# EAGLE design vestibular (EAGLE 9.6.2)
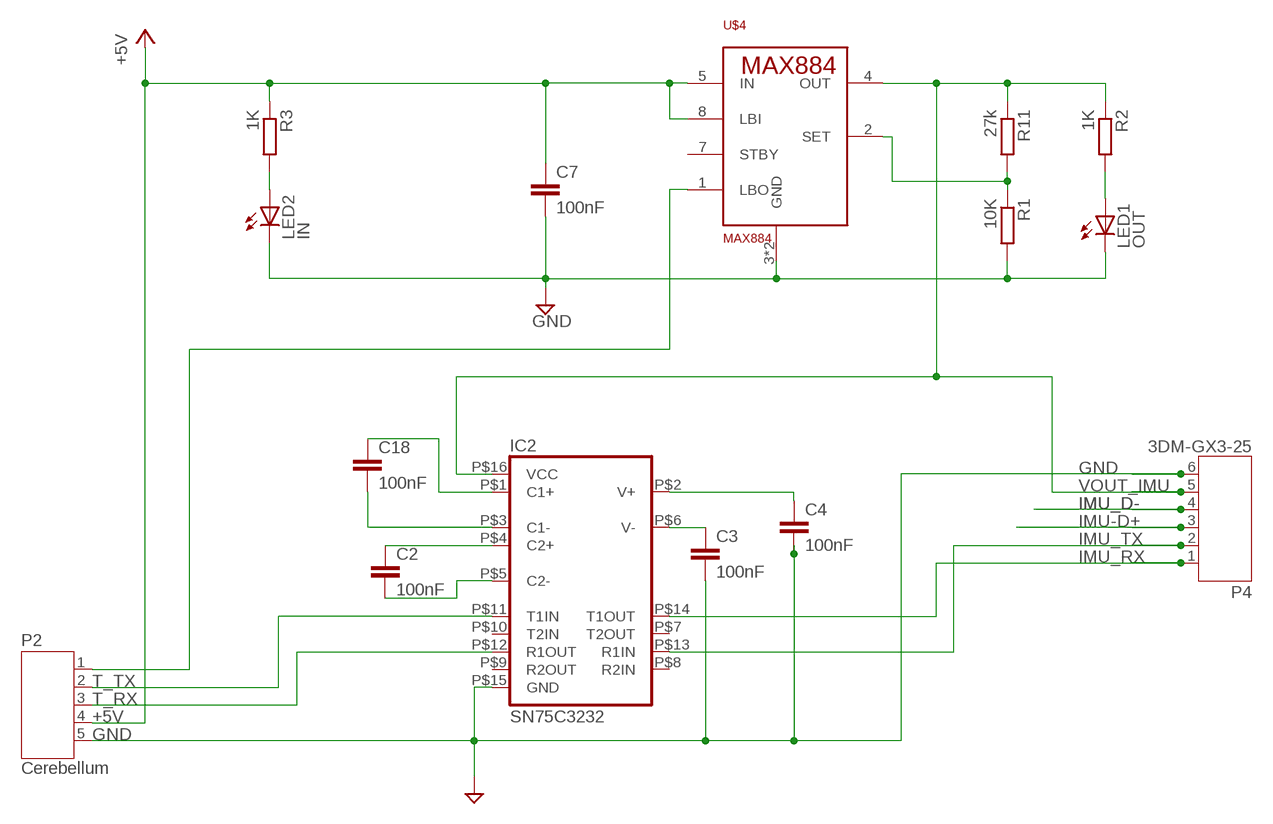
[diagram p0: schematic, sheet 1]

## Parts
C2  100nF  C-EU025-025X050  [C025-025X050]
C3  100nF  C-EU025-025X050  [C025-025X050]
C4  100nF  C-EU025-025X050  [C025-025X050]
C7  100nF  C-EU025-025X050  [C025-025X050]
C18  100nF  C-EU025-025X050  [C025-025X050]
IC2  SN75C3232  MAX3232  [SOIC16]
LED1  OUT  LED3MM  [LED3MM]
LED2  IN  LED3MM  [LED3MM]
P2  Cerebellum  JST-PH5  [JST-PH5]
P4  3DM-GX3-25  JST-PH6  [JST-PH6]
R1  10K  R-EU_0204/7  [0204/7]
R2  1K  R-EU_0204/7  [0204/7]
R3  1K  R-EU_0204/7  [0204/7]
R11  27k  R-EU_0204/7  [0204/7]
U$4  MAX884  [SO08]

## Nets
+5V: C7.1 P2.4 R3.1 U$4.5(IN) U$4.8(LBI)
GND: C3.2 C4.2 C7.2 IC2.P$15(GND) LED1.K(C) LED2.K(C) P2.5 P4.6 R1.2 U$4.3(GND) U$4.6(GND)
IMU-D+: P4.3
IMU_D-: P4.4
IMU_RX: IC2.P$14(T1OUT) P4.1
IMU_TX: IC2.P$13(R1IN) P4.2
N$1: LED1.A R2.2
N$2: LED2.A R3.2
N$6: C18.1 IC2.P$1(C1+)
N$7: P2.1 U$4.1(LBO)
N$8: C18.2 IC2.P$3(C1-)
N$9: R1.1 R11.2 U$4.2(SET)
N$11: C2.1 IC2.P$4(C2+)
N$12: C2.2 IC2.P$5(C2-)
N$13: C4.1 IC2.P$2(V+)
N$14: C3.1 IC2.P$6(V-)
T_RX: IC2.P$12(R1OUT) P2.3
T_TX: IC2.P$11(T1IN) P2.2
VOUT_IMU: IC2.P$16(VCC) P4.5 R2.1 R11.1 U$4.4(OUT)
Unconnected: IC2.P$7(T2OUT) IC2.P$8(R2IN) IC2.P$9(R2OUT) IC2.P$10(T2IN) U$4.7(STBY)

## Library data of the parts
C2-C4 C7 C18 = rcl:C-EU: CAPACITOR, European symbol; SPICEPREFIX: C
IC2 = MAX3232:MAX3232: ±15kV ESD-Protected, Down to 10nA, 3.0V to 5.5V, Up to 1Mbps, True RS-232 Transceivers Check availability <https://pricing.snapeda.com/parts/MAX3232/Maxim%20Integrated/view-part?ref=eda>; AVAILABILITY: In Stock; DESCRIPTION: 2/2 Transceiver Full RS232 16-TQFN (5x5); MF: Maxim Integrated; MP: MAX3232; PACKAGE: SOIC-16 Texas Instruments; PRICE: None; PURCHASE-URL: https://pricing.snapeda.com/search/part/MAX3232/?ref=eda
LED1 LED2 = adafruit:LED: LED OSRAM: - CHIPLED LG R971, LG N971, LY N971, LG Q971, LY Q971, LO R971, LY R971 LH N974, LH R974 LS Q976, LO Q976, LY Q976 LO Q996 - Hyper CHIPLED LW Q18S LB Q993, LB Q99A, LB R99A - SideLED LS A670, LO A670, LY A670, LG A670, LP A670 LB A673, LV A673, LT A673, LW A673 LH A674 LY A675 LS A676, LA A676, LO A676, LY A676, LW A676 LS A679, LY A679, LG A679 - Hyper Micro SIDELED® LS Y876, LA Y876, LO Y876, LY Y876 LT Y87S - SmartLED LW L88C, LW L88S LB L89C, LB L89S, LG L890 LS L89K, LO L89K, LY L89K LS L896, LA L896, LO L896, LY L896 - TOPLED LS T670, LO T670, LY T670, LG T670, LP T670 LSG T670, LSP T670, LSY T670, LOP T670, LYG T670 LG T671, LOG T671, LSG T671 LB T673, LV T673, LT T673, LW T673 LH T674 LS T676, LA T676, LO T676, LY T676, LB T676, LH T676, LSB T676, LW T676 LB T67C, LV T67C, LT T67C, LS T67K, LO T67K, LY T67K, LW E67C LS E67B, LA E67B, LO E67B, LY E67B, LB E67C, LV E67C, LT E67C LW T67C LS T679, LY T679, LG T679 LS T770, LO T770, LY T770, LG T770, LP T770 LB T773, LV T773, LT T773, LW T773 LH T774 LS E675, LA E675, LY E675, LS T675 LS T776, LA T776, LO T776, LY T776, LB T776 LHGB T686 LT T68C, LB T68C - Hyper Mini TOPLED® LB M676 - Mini TOPLED Santana® LG M470 LS M47K, LO M47K, LY M47K Source: http://www.osram.convergy.de/
P2 = jst-ph:JST-PH5
P4 = jst-ph:JST-PH6
R1-R3 R11 = rcl:R-EU_: RESISTOR, European symbol; SPICEPREFIX: R
U$4 = MAX884:MAX884: MAX884 5/3.3/Adj low Dropout, Low IQ, 200mA Linear Regulator

## Net classes
0 default: width 0.254 mm
1 Battery: width 1.575 mm

## Board
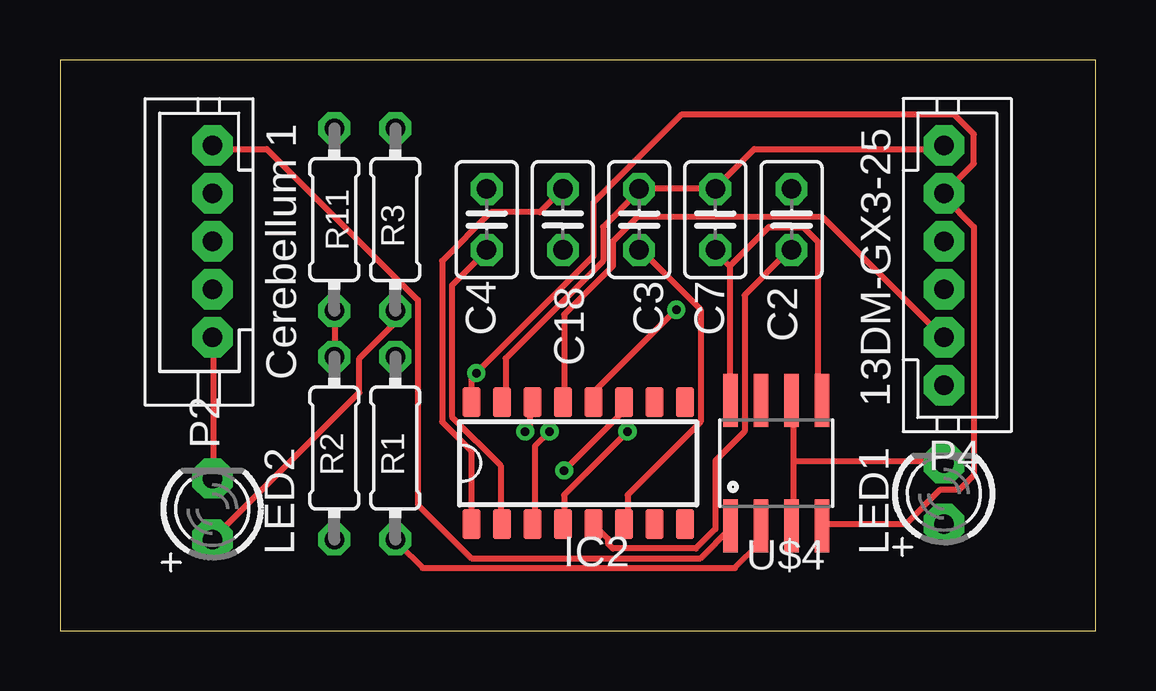
[diagram p1: board, top side]
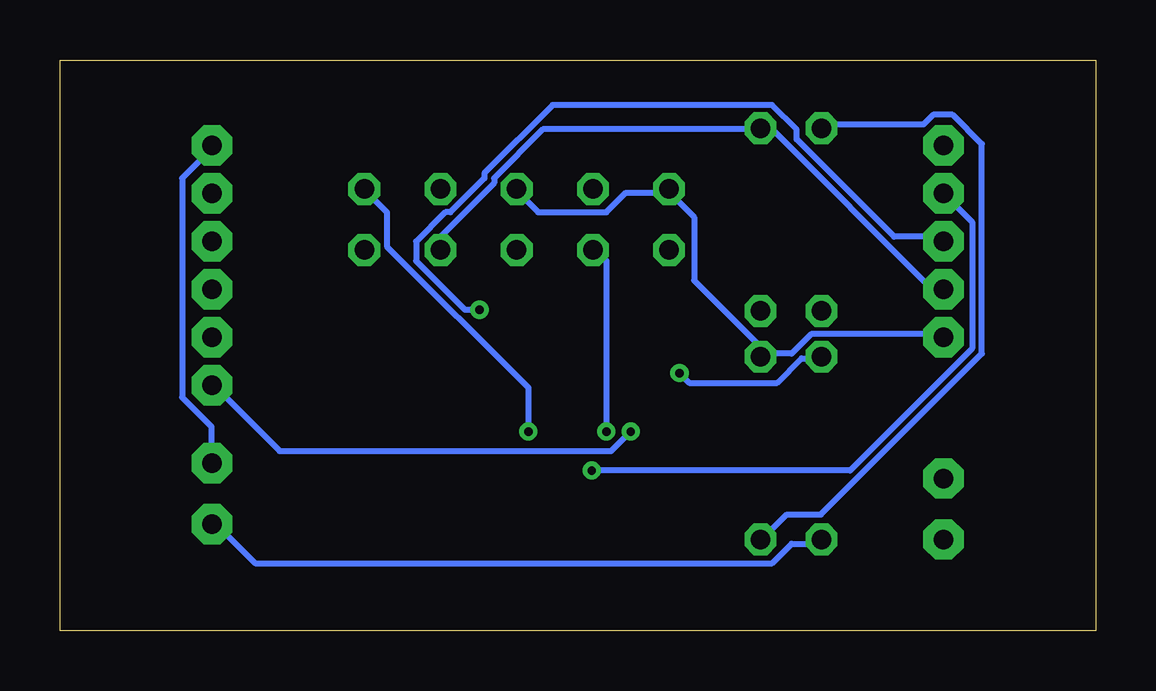
[diagram p2: board, bottom side, seen from below]

Size 43.16 x 23.8 mm. Coordinates in mm from the lower left corner, seen from the top.
Outline: 0,0 43.16,0 43.16,23.8 0,23.8 0,0
Copper layers (1*16): Top 0.035mm / dielectric 1.5mm / Bottom 0.035mm
Design rules "default": minimum track width 6mil, minimum drill 0.35mm, track to track 6mil, track to pad 6mil, pad to pad 6mil, via to via 6mil, smd to smd 6mil, copper to edge 40mil, drill to drill 6mil, minimum pad ring 10mil, minimum via ring 8mil, stop-mask expansion 4mil, vias tented up to drill 0mil, thermal gap 10mil

### Footprints (pad centres in the part's own frame; a part is rotated, then mirrored left to right if it is on the bottom)
C025-025X050 = drill 0.813 octagon: 1 -1.27,0; 2 1.27,0
SOIC16 = smd 0.75 x 1.25: P$1 -4.445,-2.54; P$2 -3.175,-2.54; P$3 -1.905,-2.54; P$4 -0.635,-2.54; P$5 0.635,-2.54; P$6 1.905,-2.54; P$7 3.175,-2.54; P$8 4.445,-2.54; P$9 4.445,2.54; P$10 3.175,2.54; P$11 1.905,2.54; P$12 0.635,2.54; P$13 -0.635,2.54; P$14 -1.905,2.54; P$15 -3.175,2.54; P$16 -4.445,2.54
LED3MM = drill 0.813 pad 1.676 octagon: A -1.27,0; K 1.27,0
JST-PH5 = drill 0.813 pad 1.676 octagon: 1 5,0; 2 3,0; 3 1,0; 4 -1,0; 5 -3,0
JST-PH6 = drill 0.813 pad 1.676 octagon: 1 5,0; 2 3,0; 3 1,0; 4 -1,0; 5 -3,0; 6 -5,0
0204/7 = drill 0.813 octagon: 1 -3.81,0; 2 3.81,0
SO08 = smd 0.61 x 2.21: 1 -1.905,-2.616; 2 -0.635,-2.616; 3 0.635,-2.616; 4 1.905,-2.616; 5 1.905,2.616; 6 0.635,2.616; 7 -0.635,2.616; 8 -1.905,2.616

### Placement (x,y rotation side)
C2  30.48,17.14 270 top
C3  24.13,17.14 90 top
C4  17.78,17.14 90 top
C7  27.3,17.14 90 top
C18  20.96,17.14 270 top
IC2  21.59,6.99 0 top
LED1  36.83,5.71 90 top
LED2  6.35,5.08 90 top
P2  6.35,15.24 90 top
P4  36.83,15.24 270 top
R1  13.97,7.62 90 top
R2  11.43,7.62 270 top
R3  13.97,17.14 270 top
R11  11.43,17.14 90 top
U$4  29.85,6.99 0 top

### Tracks (layer width: path | path; a pad name or v marks a point on that pad's centre or on a via)
+5V
  Top 0.254: 27.92,15.21 27.92,9.73 U$4.8 | 27.92,15.21 27.3,15.82 C7.1 | 27.92,15.21 29.54,16.84 30.96,16.84 31.57,16.23 31.57,9.73 U$4.5
  Bottom 0.254: P2.4 6.38,14.4 6.99,14.4 13.49,20.9 13.89,20.9 R3.1 14.1,20.9 23.04,20.9 25.07,18.87 25.07,18.67 27.3,16.43 C7.1
GND
  Top 0.254: LED2.K 6.38,6.48 6.38,12.17 P2.5 | 30.56,7.09 30.56,9.53 U$4.6 | 30.56,7.09 30.56,4.45 U$4.3 | 30.56,7.09 36.65,7.09 LED1.K | IC2.P$15 18.57,9.53 18.57,11.35 22.63,15.42 22.63,16.84 24.05,18.26 C3.2 24.26,18.47 27.3,18.47 | 27.3,18.47 28.93,20.09 36.65,20.09 P4.6 | 27.3,18.47 C7.2
  Bottom 0.254: P2.5 6.38,12.37 11.86,12.37 12.68,11.56 13.89,11.56 R1.2 14.1,11.56 14.1,11.96 16.74,14.61 16.74,17.25 17.76,18.26 C4.2 17.96,18.26 19.58,18.26 20.4,17.45 23.24,17.45 24.05,18.26 C3.2 | LED1.K 36.86,7.09 36.86,8.51 38.08,9.73 38.08,18.87 36.86,20.09 P4.6
IMU_RX  (via drill 0.35)
  Top 0.254: v19.38,8.31 19.58,8.51 19.58,9.53 IC2.P$14
  Bottom 0.254: v19.38,8.31 20.19,7.49 34.01,7.49 36.65,10.14 P4.1
IMU_TX
  Top 0.254: IC2.P$13 21.01,9.53 21.01,13.18 23.04,15.21 23.04,16.23 24.05,17.25 31.78,17.25 36.65,12.37 P4.2
N$1
  Bottom 0.254: R2.2 11.46,3.63 12.68,3.63 13.49,2.82 35.03,2.82 36.65,4.45 LED1.A
N$2
  Top 0.254: LED2.A 12.47,9.93 12.47,11.35 13.89,12.78 13.89,13.18 R3.2
N$6
  Top 0.254: IC2.P$1 17.15,7.49 15.93,8.71 15.93,15.42 17.96,17.45 19.99,17.45 C18.1
N$7
  Top 0.254: U$4.1 27.92,4.24 26.7,3.02 17.15,3.02 14.91,5.26 14.91,13.79 8.61,20.09 6.38,20.09 P2.1
N$8  (via drill 0.35)
  Top 0.254: v20.4,8.31 19.79,7.7 19.79,4.45 IC2.P$3
  Bottom 0.254: v20.4,8.31 20.4,15.42 20.8,15.82 C18.2
N$9
  Top 0.254: U$4.2 29.13,4.24 29.13,3.63 28.12,2.62 15.11,2.62 14.1,3.63 R1.1
  Bottom 0.254: R11.2 11.25,21.11 7.19,21.11 6.78,21.51 5.97,21.51 4.75,20.3 4.75,11.56 11.46,4.85 12.88,4.85 13.89,3.84 R1.1
N$11  (via drill 0.35)
  Top 0.254: v23.65,8.31 21.01,5.66 21.01,4.45 IC2.P$4
  Bottom 0.254: v23.65,8.31 23.65,10.14 29.54,16.03 29.54,17.45 30.35,18.26 C2.1
N$12
  Top 0.254: IC2.P$5 22.84,3.84 22.84,3.63 23.04,3.43 26.49,3.43 27.3,4.24 27.3,7.09 28.52,8.31 28.52,14 30.35,15.82 C2.2
N$13
  Top 0.254: IC2.P$2 18.36,4.45 18.36,6.88 16.33,8.91 16.33,14.4 17.76,15.82 C4.1
N$14
  Top 0.254: IC2.P$6 23.65,4.45 23.65,5.66 26.7,8.71 26.7,13.39 24.26,15.82 C3.1
T_RX  (via drill 0.35)
  Top 0.254: IC2.P$12 22.23,9.93 v25.68,13.39
  Bottom 0.254: v25.68,13.39 26.29,13.39 28.32,15.42 28.32,16.23 27.1,17.45 26.9,17.45 25.48,18.87 25.48,19.08 22.63,21.92 13.49,21.92 12.47,20.9 12.47,20.5 8.41,16.43 6.38,16.43 P2.3
T_TX  (via drill 0.35)
  Top 0.254: v21.01,6.68 23.44,9.12 23.44,9.53 IC2.P$11
  Bottom 0.254: v21.01,6.68 10.24,6.68 5.16,11.76 5.16,17.04 6.17,18.06 P2.2
VOUT_IMU  (via drill 0.35)
  Top 0.254: R2.1 11.46,11.56 11.46,13.18 R11.1 | IC2.P$16 17.15,10.54 v17.35,10.74 22.23,15.62 22.23,17.86 25.88,21.51 37.26,21.51 38.08,20.7 38.08,19.48 36.86,18.26 P4.5 36.86,18.06 38.08,16.84 38.08,6.48 37.47,5.87 36.65,5.87 35.23,4.45 31.78,4.45 U$4.4
  Bottom 0.254: v17.35,10.74 16.94,10.34 13.28,10.34 12.27,11.35 11.46,11.35 R2.1

### Text on the board
tValues: SHTD | GND | TX | VOUT | RX | D- | +5V | D+ | TX | GND | RX | Vestibular 1.0